# Altium schematic sheet Switch.SchDoc
size A; SheetNumber: 4; SheetTotal: 4
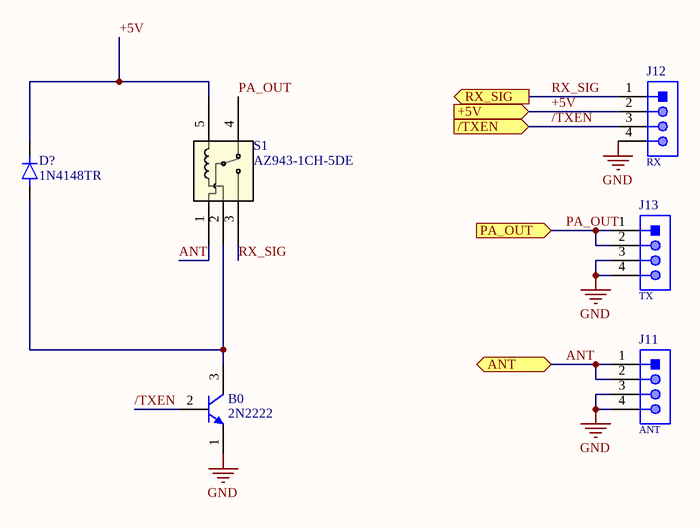
[diagram p0: Switch.SchDoc]

## Parts
B0  2N2222  [MLTC-TO-18-3]
D?  1N4148TR  [DIOAD753W49L380D172B]
J11  ANT  [61300411121]
J12  RX  [61300411121]
J13  TX  [61300411121]
S1  AZ943-1CH-5DE  [K_AZ943-1C_AMZ]

## Ports
+5V (in), /TXEN (in), ANT (bidir), PA_OUT (in), RX_SIG (out)

## Nets
GND: B0.1(E) J11.3 J11.4 J12.4 J13.3 J13.4
+5V: D?.K J12.2 S1.5 ; port +5V
/TXEN: B0.2(B) J12.3 ; port /TXEN
ANT: J11.1 J11.2 S1.1 ; port ANT
PA_OUT: J13.1 J13.2 S1.4 ; port PA_OUT
RX_SIG: J12.1 S1.3 ; port RX_SIG
NetB0_3: B0.3(C) D?.A S1.2

## Library data of the parts
B0 = CMP-2000-05237-1: Low Power Bipolar NPN Transistor, 30 V, -65 to 200 degC, 3-Pin TO-18, RoHS, Bulk; Manufacturer: Multicomp; Pin Configuration: a; No. of Pins: 3; No. of Transistors: 1; Collector Emitter Voltage Vces: 400mV; Current Ic Continuous a Max: 800mA; Power Dissipation Pd: 500mW; Collector Emitter Voltage V(br)ceo: 30V; Gain Bandwidth ft Typ: 250MHz; Voltage Vcbo: 60V; DC Current Gain hFE: 100; Full Power Rating Temperature: 25degC; Current Ic @ Vce Sat: 150mA; SVHC: NoSVHC(19-Dec-2012); Package Reference: TO-18-3; Package Description: 3-Pin Transistor Outline Package (TO-18), Dia 5.54 mm, Pitch Pitch 1.485mm; Datasheet URL: http://www.farnell.com/datasheets/1662272.pdf; Transistor Case Style: TO-18; Continuous Collector Current Ic Max: 800mA; Manufacturer URL: http://uk.farnell.com/b/multicomp; DC Collector Current: 800mA; Hfe Min: 100; Transistor Polarity: NPN; Power Dissipation Ptot Max: 500mW; Package / Case: TO-18; Datasheet Version: Rev. 1.1, 05/2012; Gain Bandwidth ft Min: 250MHz; Current Ic hFE: 150mA
D? = 1N4148TR: MF: {'manufacturer': u'onsemi'}; Package: None; Price: None; Value: *; MP: 1N4148TR; Availability: Unavailable
J11-J13 = CMP-1502-01064-1: THT Vertical Pin Header WR-PHD, Pitch 2.54 mm, Single Row, 4 pins; Manufacturer: Wurth Elektronik; Withstanding Voltage: 500VAC; Rated Current: 3A; Working Voltage: 250VAC; Pin Number: 4; Gender: Male; Contact Resistance: 20mOhm; Pitch: 2.54mm; Manufacturer URL: http://www.we-online.de; Operating Temperature: -40to105degC; Packaging: Bag; Mounting Technology: THT; Package Reference: 61300411121; Datasheet URL: https://katalog.we-online.de/em/datasheet/6130xx11121.pdf; Publisher: WurthElektronik; Part Number: 61300411121; Row Number: Single; Orientation: Vertical
S1 = AZ943-1CH-5DE: No Description Available; Mfr_Name: American Zettler; Type: Power Relays; RefDes: RefDes